# Altium project POETIC_Backplane_V2.PrjPcb
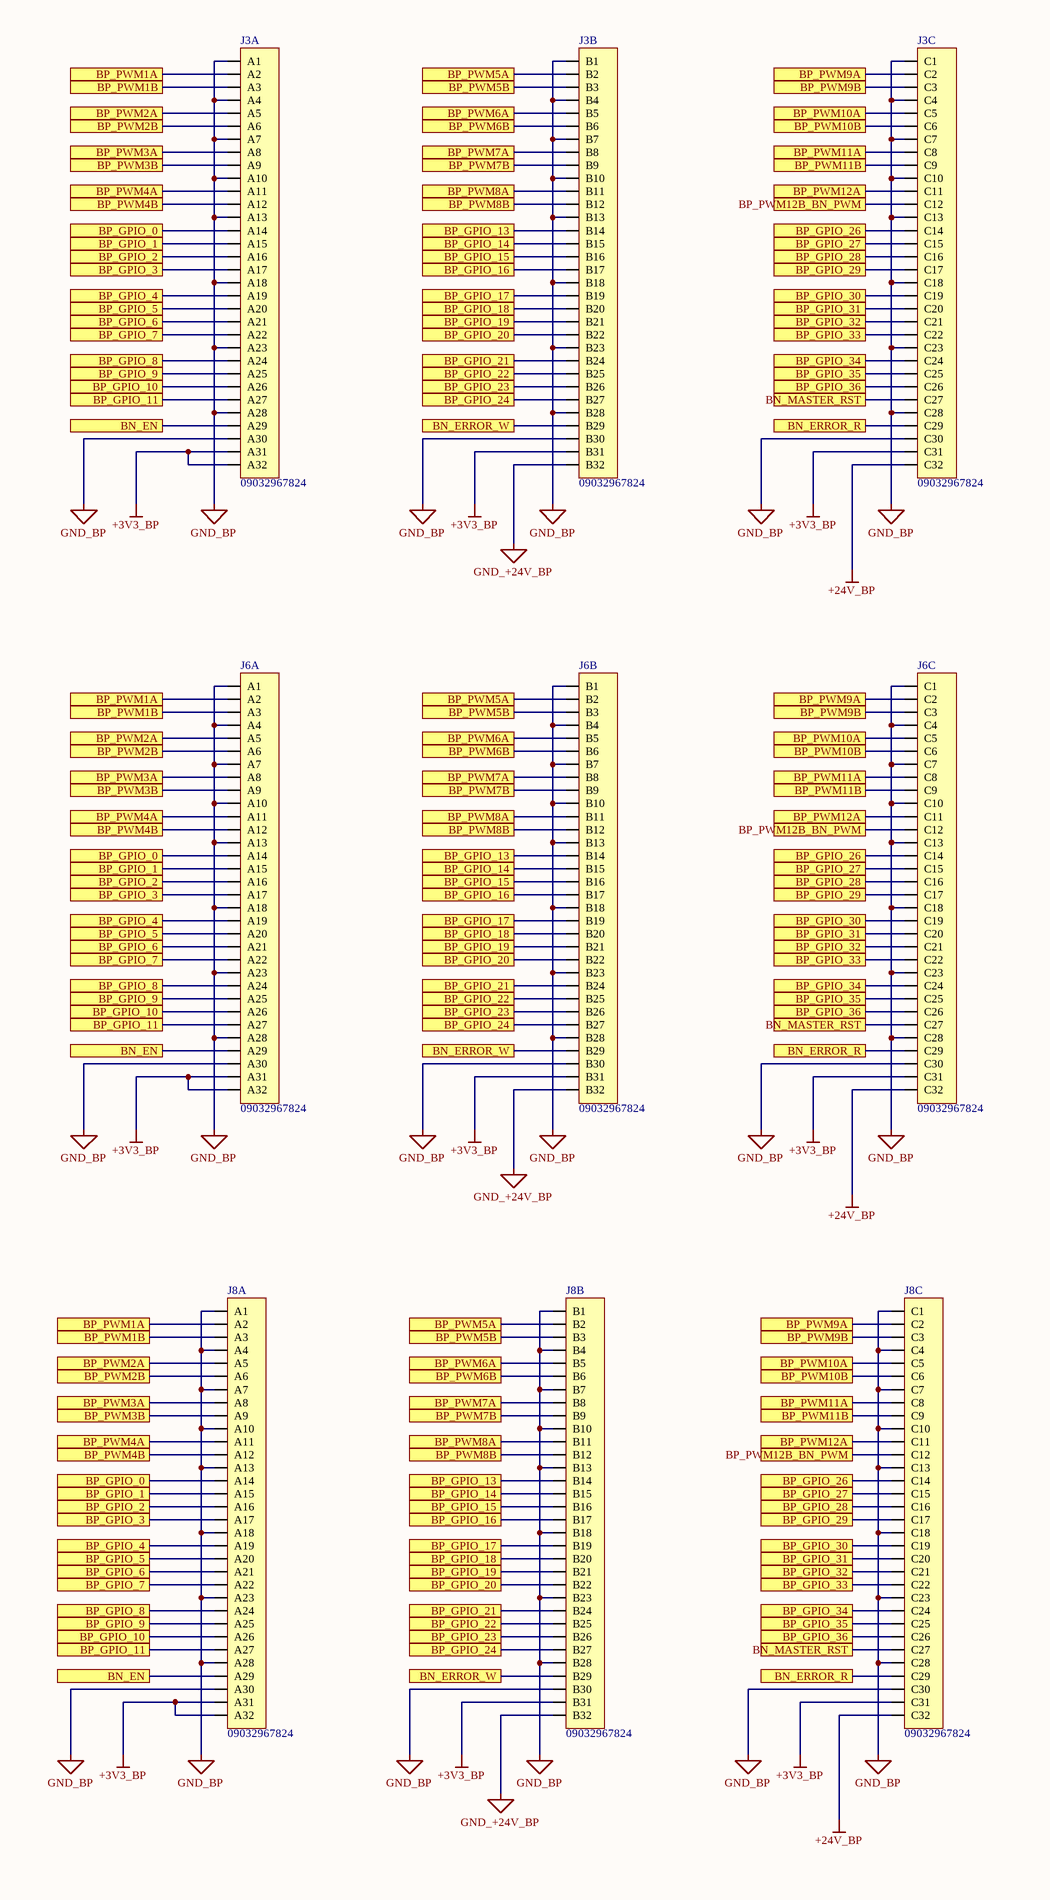
[diagram p0: Connector_1.SchDoc, left]
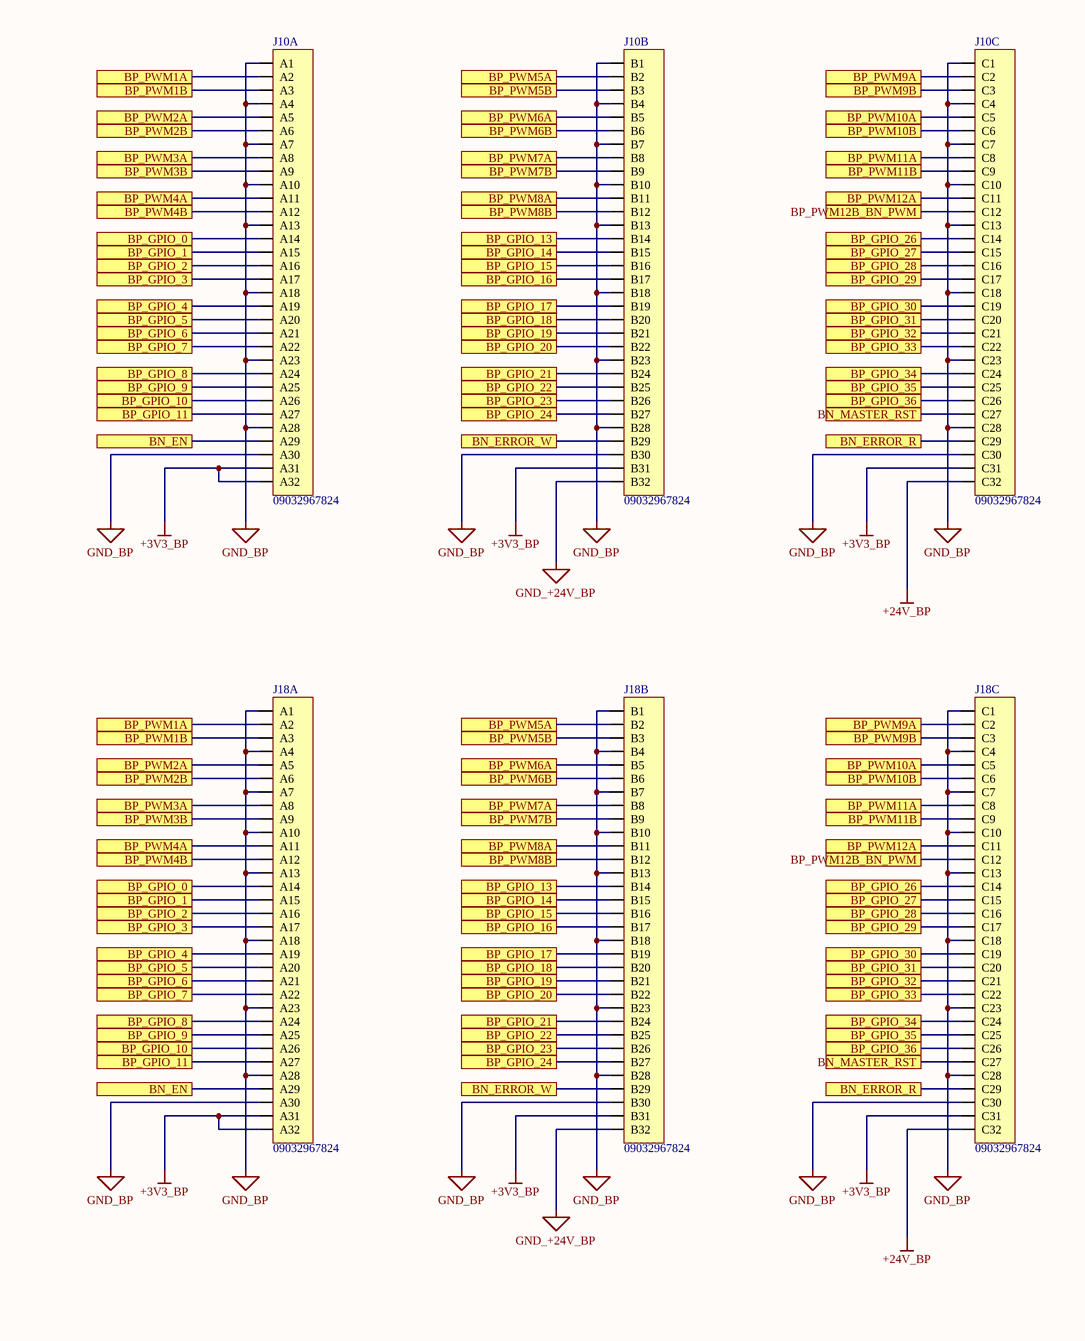
[diagram p1: Connector_1.SchDoc, right]
PcbDate: 13.03.2018; PcbDesigner: ARC; PcbRevision: 1.0; SchematicDate: 09.05.2019; SchematicDesigner: GIN/GEA; SchematicRevision: 2.0
3 sheets, 40 parts. Net scope: global (net labels, ports and power ports of the same name join across sheets).
Board file: POETIC_Backplane_V2.PcbDoc
Sheets:
  Connector_1.SchDoc
  Connector_3.SchDoc
  Supply.SchDoc

## Sheet Connector_1.SchDoc
size A2; Date: Date; CompanyName: HESSO; Engineer: Name; Address1: Route du Rawyl 47; Address2: 1950 Sion; Address3: Switzerland; DocumentNumber: 2; SheetNumber: 2; SheetTotal: 3; ProjectName: Project Name

### Parts
J3  09032967824  [DIN41612 FEM 3x32 ABC Straight]  (parts A,B,C of 3)
J6  09032967824  [DIN41612 FEM 3x32 ABC Straight]  (parts A,B,C of 3)
J8  09032967824  [DIN41612 FEM 3x32 ABC Straight]  (parts A,B,C of 3)
J10  09032967824  [DIN41612 FEM 3x32 ABC Straight]  (parts A,B,C of 3)
J18  09032967824  [DIN41612 FEM 3x32 ABC Straight]  (parts A,B,C of 3)

### Ports
BN_EN, BN_ERROR_R, BN_ERROR_W, BN_MASTER_RST, BP_GPIO_0, BP_GPIO_1, BP_GPIO_2, BP_GPIO_3, BP_GPIO_4, BP_GPIO_5, BP_GPIO_6, BP_GPIO_7, BP_GPIO_8, BP_GPIO_9, BP_GPIO_10, BP_GPIO_11, BP_GPIO_13, BP_GPIO_14, BP_GPIO_15, BP_GPIO_16, BP_GPIO_17, BP_GPIO_18, BP_GPIO_19, BP_GPIO_20, BP_GPIO_21, BP_GPIO_22, BP_GPIO_23, BP_GPIO_24, BP_GPIO_26, BP_GPIO_27, BP_GPIO_28, BP_GPIO_29, BP_GPIO_30, BP_GPIO_31, BP_GPIO_32, BP_GPIO_33, BP_GPIO_34, BP_GPIO_35, BP_GPIO_36, BP_PWM1A, BP_PWM1B, BP_PWM2A, BP_PWM2B, BP_PWM3A, BP_PWM3B, BP_PWM4A, BP_PWM4B, BP_PWM5A, BP_PWM5B, BP_PWM6A, BP_PWM6B, BP_PWM7A, BP_PWM7B, BP_PWM8A, BP_PWM8B, BP_PWM9A, BP_PWM9B, BP_PWM10A, BP_PWM10B, BP_PWM11A, BP_PWM11B, BP_PWM12A, BP_PWM12B_BN_PWM

### Nets
+3V3_BP: J3.A31 J3.A32 J3.B31 J3.C31 J6.A31 J6.A32 J6.B31 J6.C31 J8.A31 J8.A32 J8.B31 J8.C31 J10.A31 J10.A32 J10.B31 J10.C31 J18.A31 J18.A32 J18.B31 J18.C31
+24V_BP: J3.C32 J6.C32 J8.C32 J10.C32 J18.C32
GND_+24V_BP: J3.B32 J6.B32 J8.B32 J10.B32 J18.B32
GND_BP: J3.A1 J3.A4 J3.A7 J3.A10 J3.A13 J3.A18 J3.A23 J3.A28 J3.A30 J3.B1 J3.B4 J3.B7 J3.B10 J3.B13 J3.B18 J3.B23 J3.B28 J3.B30 J3.C1 J3.C4 J3.C7 J3.C10 J3.C13 J3.C18 J3.C23 J3.C28 J3.C30 J6.A1 J6.A4 J6.A7 J6.A10 J6.A13 J6.A18 J6.A23 J6.A28 J6.A30 J6.B1 J6.B4 J6.B7 J6.B10 J6.B13 J6.B18 J6.B23 J6.B28 J6.B30 J6.C1 J6.C4 J6.C7 J6.C10 J6.C13 J6.C18 J6.C23 J6.C28 J6.C30 J8.A1 J8.A4 J8.A7 J8.A10 J8.A13 J8.A18 J8.A23 J8.A28 J8.A30 J8.B1 J8.B4 J8.B7 J8.B10 J8.B13 J8.B18 J8.B23 J8.B28 J8.B30 J8.C1 J8.C4 J8.C7 J8.C10 J8.C13 J8.C18 J8.C23 J8.C28 J8.C30 J10.A1 J10.A4 J10.A7 J10.A10 J10.A13 J10.A18 J10.A23 J10.A28 J10.A30 J10.B1 J10.B4 J10.B7 J10.B10 J10.B13 J10.B18 J10.B23 J10.B28 J10.B30 J10.C1 J10.C4 J10.C7 J10.C10 J10.C13 J10.C18 J10.C23 J10.C28 J10.C30 J18.A1 J18.A4 J18.A7 J18.A10 J18.A13 J18.A18 J18.A23 J18.A28 J18.A30 J18.B1 J18.B4 J18.B7 J18.B10 J18.B13 J18.B18 J18.B23 J18.B28 J18.B30 J18.C1 J18.C4 J18.C7 J18.C10 J18.C13 J18.C18 J18.C23 J18.C28 J18.C30
BN_EN: J3.A29 J6.A29 J8.A29 J10.A29 J18.A29 ; port BN_EN
BN_ERROR_R: J3.C29 J6.C29 J8.C29 J10.C29 J18.C29 ; port BN_ERROR_R
BN_ERROR_W: J3.B29 J6.B29 J8.B29 J10.B29 J18.B29 ; port BN_ERROR_W
BN_MASTER_RST: J3.C27 J6.C27 J8.C27 J10.C27 J18.C27 ; port BN_MASTER_RST
BP_GPIO_0: J3.A14 J6.A14 J8.A14 J10.A14 J18.A14 ; port BP_GPIO_0
BP_GPIO_1: J3.A15 J6.A15 J8.A15 J10.A15 J18.A15 ; port BP_GPIO_1
BP_GPIO_2: J3.A16 J6.A16 J8.A16 J10.A16 J18.A16 ; port BP_GPIO_2
BP_GPIO_3: J3.A17 J6.A17 J8.A17 J10.A17 J18.A17 ; port BP_GPIO_3
BP_GPIO_4: J3.A19 J6.A19 J8.A19 J10.A19 J18.A19 ; port BP_GPIO_4
BP_GPIO_5: J3.A20 J6.A20 J8.A20 J10.A20 J18.A20 ; port BP_GPIO_5
BP_GPIO_6: J3.A21 J6.A21 J8.A21 J10.A21 J18.A21 ; port BP_GPIO_6
BP_GPIO_7: J3.A22 J6.A22 J8.A22 J10.A22 J18.A22 ; port BP_GPIO_7
BP_GPIO_8: J3.A24 J6.A24 J8.A24 J10.A24 J18.A24 ; port BP_GPIO_8
BP_GPIO_9: J3.A25 J6.A25 J8.A25 J10.A25 J18.A25 ; port BP_GPIO_9
BP_GPIO_10: J3.A26 J6.A26 J8.A26 J10.A26 J18.A26 ; port BP_GPIO_10
BP_GPIO_11: J3.A27 J6.A27 J8.A27 J10.A27 J18.A27 ; port BP_GPIO_11
BP_GPIO_13: J3.B14 J6.B14 J8.B14 J10.B14 J18.B14 ; port BP_GPIO_13
BP_GPIO_14: J3.B15 J6.B15 J8.B15 J10.B15 J18.B15 ; port BP_GPIO_14
BP_GPIO_15: J3.B16 J6.B16 J8.B16 J10.B16 J18.B16 ; port BP_GPIO_15
BP_GPIO_16: J3.B17 J6.B17 J8.B17 J10.B17 J18.B17 ; port BP_GPIO_16
BP_GPIO_17: J3.B19 J6.B19 J8.B19 J10.B19 J18.B19 ; port BP_GPIO_17
BP_GPIO_18: J3.B20 J6.B20 J8.B20 J10.B20 J18.B20 ; port BP_GPIO_18
BP_GPIO_19: J3.B21 J6.B21 J8.B21 J10.B21 J18.B21 ; port BP_GPIO_19
BP_GPIO_20: J3.B22 J6.B22 J8.B22 J10.B22 J18.B22 ; port BP_GPIO_20
BP_GPIO_21: J3.B24 J6.B24 J8.B24 J10.B24 J18.B24 ; port BP_GPIO_21
BP_GPIO_22: J3.B25 J6.B25 J8.B25 J10.B25 J18.B25 ; port BP_GPIO_22
BP_GPIO_23: J3.B26 J6.B26 J8.B26 J10.B26 J18.B26 ; port BP_GPIO_23
BP_GPIO_24: J3.B27 J6.B27 J8.B27 J10.B27 J18.B27 ; port BP_GPIO_24
BP_GPIO_26: J3.C14 J6.C14 J8.C14 J10.C14 J18.C14 ; port BP_GPIO_26
BP_GPIO_27: J3.C15 J6.C15 J8.C15 J10.C15 J18.C15 ; port BP_GPIO_27
BP_GPIO_28: J3.C16 J6.C16 J8.C16 J10.C16 J18.C16 ; port BP_GPIO_28
BP_GPIO_29: J3.C17 J6.C17 J8.C17 J10.C17 J18.C17 ; port BP_GPIO_29
BP_GPIO_30: J3.C19 J6.C19 J8.C19 J10.C19 J18.C19 ; port BP_GPIO_30
BP_GPIO_31: J3.C20 J6.C20 J8.C20 J10.C20 J18.C20 ; port BP_GPIO_31
BP_GPIO_32: J3.C21 J6.C21 J8.C21 J10.C21 J18.C21 ; port BP_GPIO_32
BP_GPIO_33: J3.C22 J6.C22 J8.C22 J10.C22 J18.C22 ; port BP_GPIO_33
BP_GPIO_34: J3.C24 J6.C24 J8.C24 J10.C24 J18.C24 ; port BP_GPIO_34
BP_GPIO_35: J3.C25 J6.C25 J8.C25 J10.C25 J18.C25 ; port BP_GPIO_35
BP_GPIO_36: J3.C26 J6.C26 J8.C26 J10.C26 J18.C26 ; port BP_GPIO_36
BP_PWM1A: J3.A2 J6.A2 J8.A2 J10.A2 J18.A2 ; port BP_PWM1A
BP_PWM1B: J3.A3 J6.A3 J8.A3 J10.A3 J18.A3 ; port BP_PWM1B
BP_PWM2A: J3.A5 J6.A5 J8.A5 J10.A5 J18.A5 ; port BP_PWM2A
BP_PWM2B: J3.A6 J6.A6 J8.A6 J10.A6 J18.A6 ; port BP_PWM2B
BP_PWM3A: J3.A8 J6.A8 J8.A8 J10.A8 J18.A8 ; port BP_PWM3A
BP_PWM3B: J3.A9 J6.A9 J8.A9 J10.A9 J18.A9 ; port BP_PWM3B
BP_PWM4A: J3.A11 J6.A11 J8.A11 J10.A11 J18.A11 ; port BP_PWM4A
BP_PWM4B: J3.A12 J6.A12 J8.A12 J10.A12 J18.A12 ; port BP_PWM4B
BP_PWM5A: J3.B2 J6.B2 J8.B2 J10.B2 J18.B2 ; port BP_PWM5A
BP_PWM5B: J3.B3 J6.B3 J8.B3 J10.B3 J18.B3 ; port BP_PWM5B
BP_PWM6A: J3.B5 J6.B5 J8.B5 J10.B5 J18.B5 ; port BP_PWM6A
BP_PWM6B: J3.B6 J6.B6 J8.B6 J10.B6 J18.B6 ; port BP_PWM6B
BP_PWM7A: J3.B8 J6.B8 J8.B8 J10.B8 J18.B8 ; port BP_PWM7A
BP_PWM7B: J3.B9 J6.B9 J8.B9 J10.B9 J18.B9 ; port BP_PWM7B
BP_PWM8A: J3.B11 J6.B11 J8.B11 J10.B11 J18.B11 ; port BP_PWM8A
BP_PWM8B: J3.B12 J6.B12 J8.B12 J10.B12 J18.B12 ; port BP_PWM8B
BP_PWM9A: J3.C2 J6.C2 J8.C2 J10.C2 J18.C2 ; port BP_PWM9A
BP_PWM9B: J3.C3 J6.C3 J8.C3 J10.C3 J18.C3 ; port BP_PWM9B
BP_PWM10A: J3.C5 J6.C5 J8.C5 J10.C5 J18.C5 ; port BP_PWM10A
BP_PWM10B: J3.C6 J6.C6 J8.C6 J10.C6 J18.C6 ; port BP_PWM10B
BP_PWM11A: J3.C8 J6.C8 J8.C8 J10.C8 J18.C8 ; port BP_PWM11A
BP_PWM11B: J3.C9 J6.C9 J8.C9 J10.C9 J18.C9 ; port BP_PWM11B
BP_PWM12A: J3.C11 J6.C11 J8.C11 J10.C11 J18.C11 ; port BP_PWM12A
BP_PWM12B_BN_PWM: J3.C12 J6.C12 J8.C12 J10.C12 J18.C12 ; port BP_PWM12B_BN_PWM

### Notes on the sheet
- Date :
- Revision :
- Sheet
- of
- Design by :

### Library data of the parts
J3 J6 J8 J10 J18 = DIN41612 FEM 3X32 STRAIGHT: DIN41612 FEM 3X32 ABC STRAIGHT; Manufacturer: Harting; Mouser No.: 617-09032967824; Value: 09032967824

## Sheet Connector_3.SchDoc
size A2; Date: Date; CompanyName: HESSO; Engineer: Name; Address1: Route du Rawyl 47; Address2: 1950 Sion; Address3: Switzerland; DocumentNumber: 2; SheetNumber: 2; SheetTotal: 3; ProjectName: Project Name
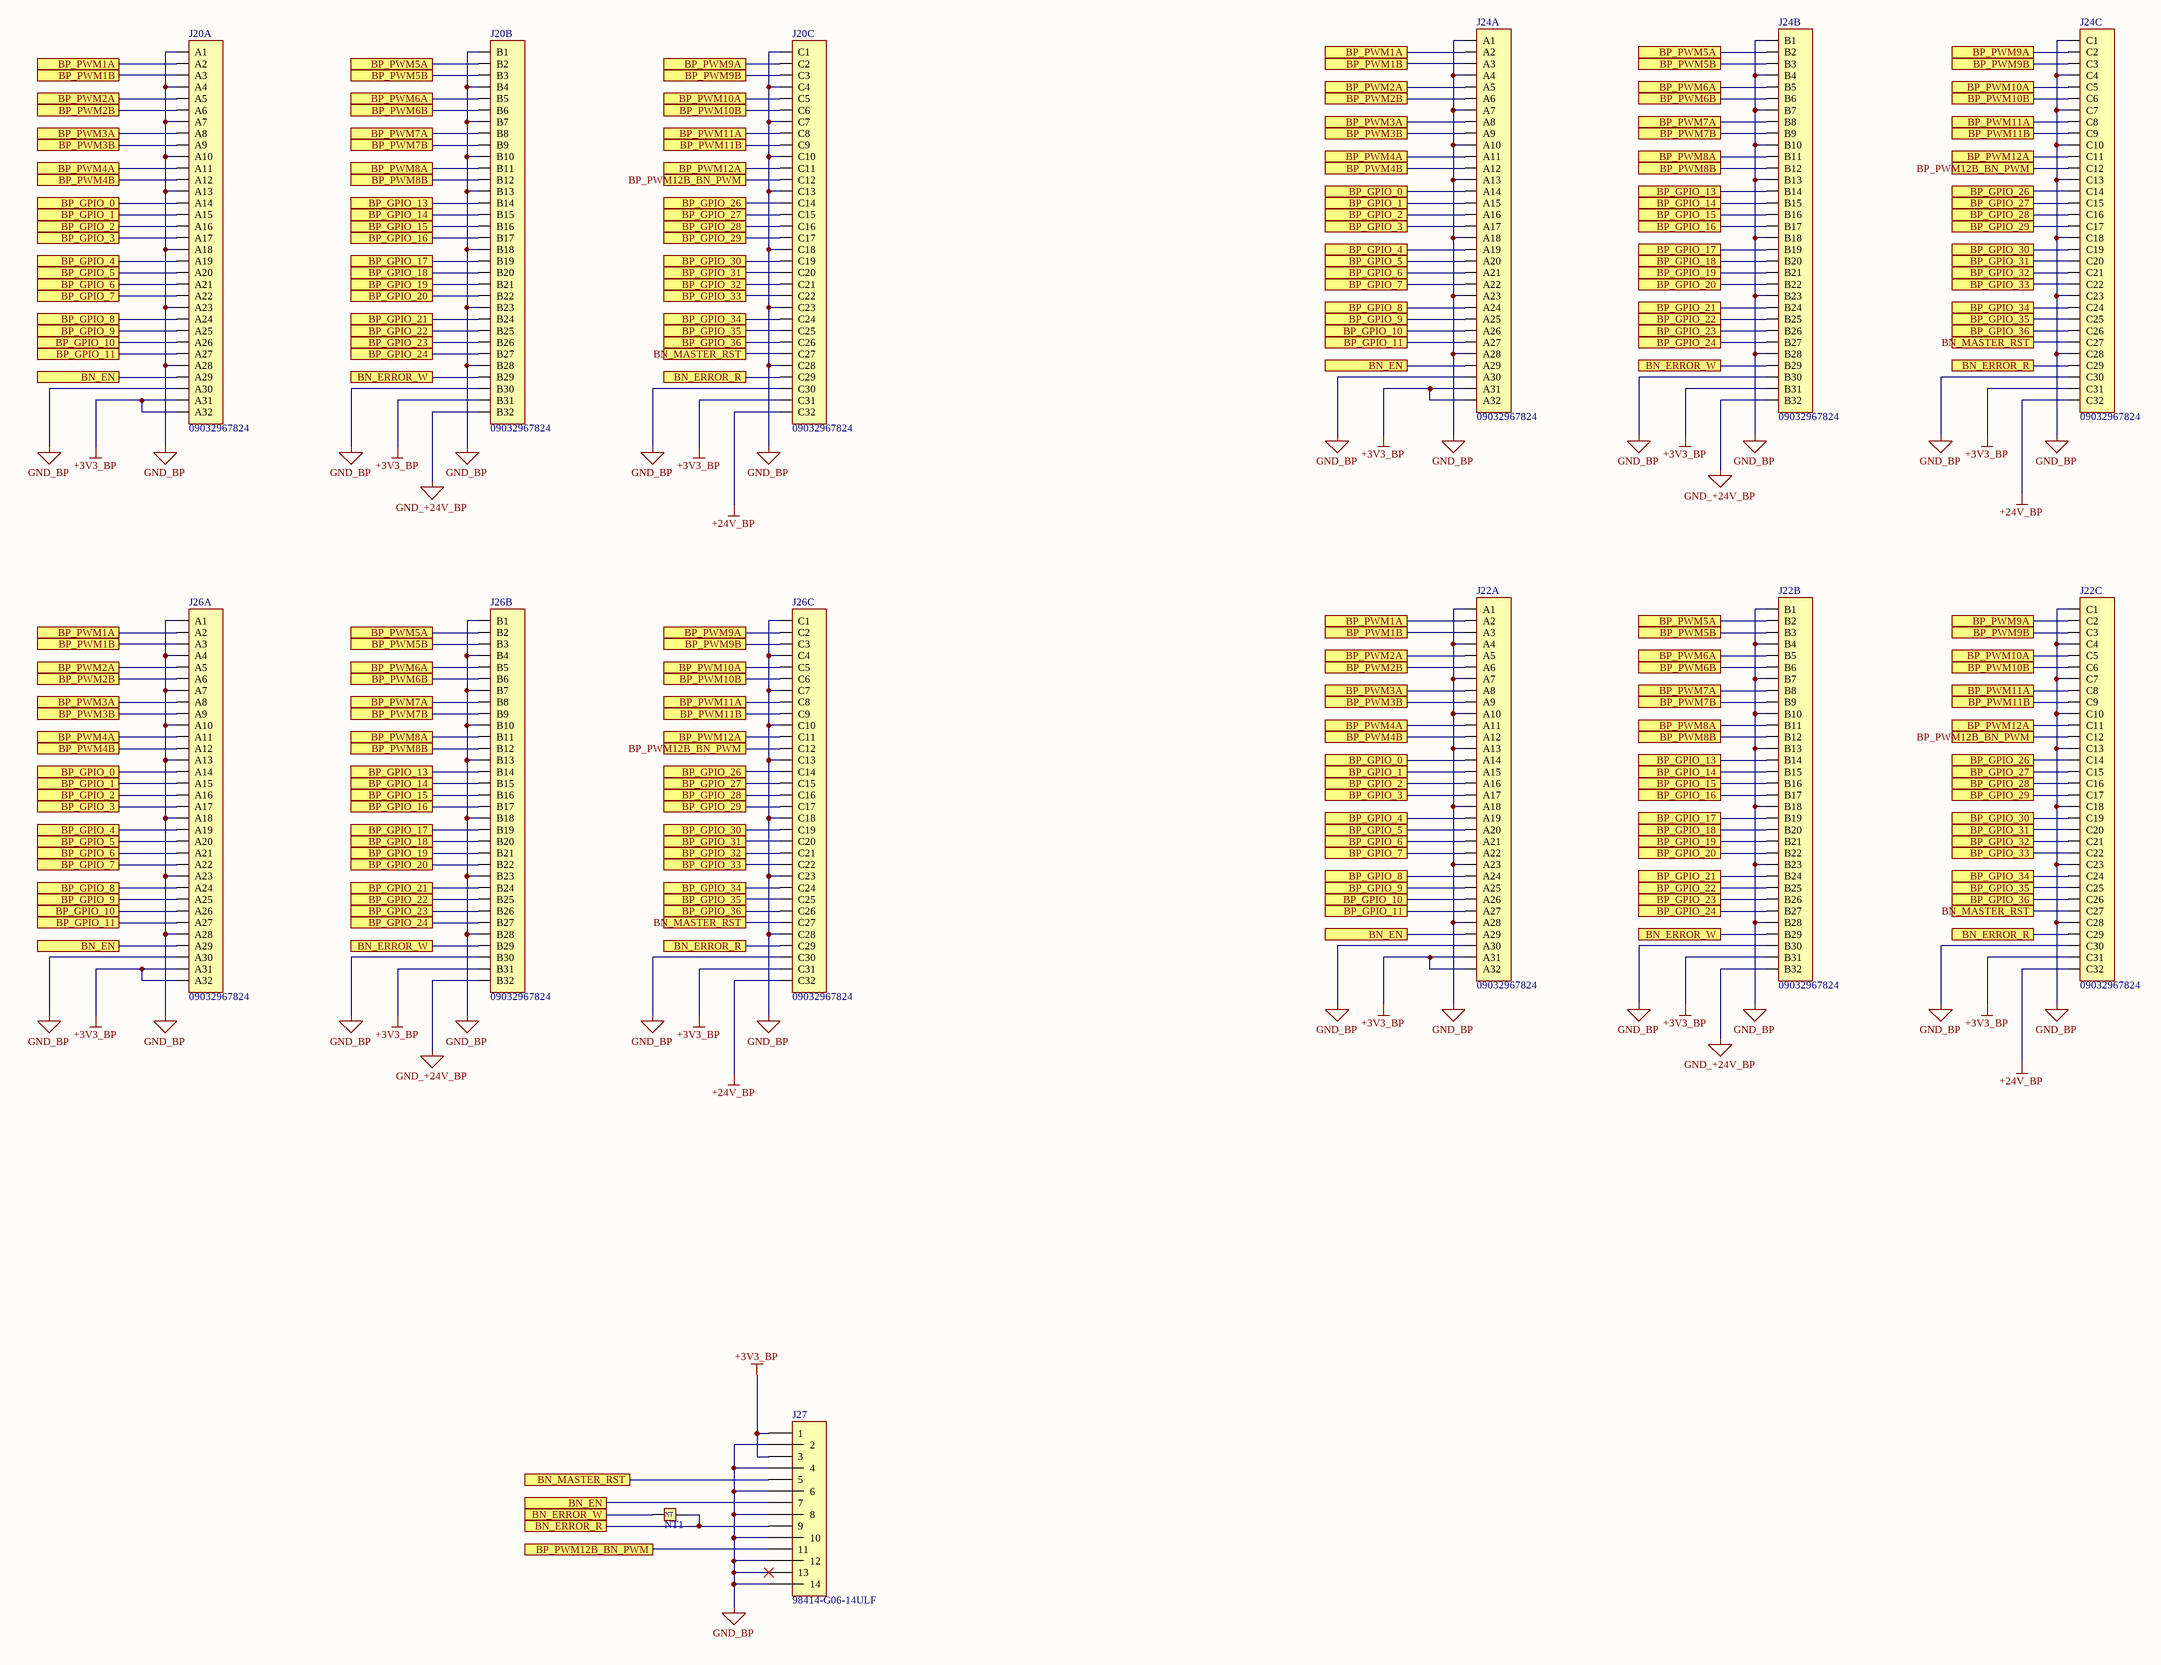
[diagram p2: Connector_3.SchDoc]

### Parts
J20  09032967824  [DIN41612 FEM 3x32 ABC Straight]  (parts A,B,C of 3)
J22  09032967824  [DIN41612 FEM 3x32 ABC Straight]  (parts A,B,C of 3)
J24  09032967824  [DIN41612 FEM 3x32 ABC Straight]  (parts A,B,C of 3)
J26  09032967824  [DIN41612 FEM 3x32 ABC Straight]  (parts A,B,C of 3)
J27  98414-G06-14ULF  [FlatCable2x7 2MM Straight TH FCI 98414-G06-14ULF]
NT1  Net Tie  [NET TIE 1005]  (value not drawn)  (net tie, no BOM)

### Ports
BN_EN, BN_ERROR_R, BN_ERROR_W, BN_MASTER_RST, BP_GPIO_0, BP_GPIO_1, BP_GPIO_2, BP_GPIO_3, BP_GPIO_4, BP_GPIO_5, BP_GPIO_6, BP_GPIO_7, BP_GPIO_8, BP_GPIO_9, BP_GPIO_10, BP_GPIO_11, BP_GPIO_13, BP_GPIO_14, BP_GPIO_15, BP_GPIO_16, BP_GPIO_17, BP_GPIO_18, BP_GPIO_19, BP_GPIO_20, BP_GPIO_21, BP_GPIO_22, BP_GPIO_23, BP_GPIO_24, BP_GPIO_26, BP_GPIO_27, BP_GPIO_28, BP_GPIO_29, BP_GPIO_30, BP_GPIO_31, BP_GPIO_32, BP_GPIO_33, BP_GPIO_34, BP_GPIO_35, BP_GPIO_36, BP_PWM1A, BP_PWM1B, BP_PWM2A, BP_PWM2B, BP_PWM3A, BP_PWM3B, BP_PWM4A, BP_PWM4B, BP_PWM5A, BP_PWM5B, BP_PWM6A, BP_PWM6B, BP_PWM7A, BP_PWM7B, BP_PWM8A, BP_PWM8B, BP_PWM9A, BP_PWM9B, BP_PWM10A, BP_PWM10B, BP_PWM11A, BP_PWM11B, BP_PWM12A, BP_PWM12B_BN_PWM

### Nets
+3V3_BP: J20.A31 J20.A32 J20.B31 J20.C31 J22.A31 J22.A32 J22.B31 J22.C31 J24.A31 J24.A32 J24.B31 J24.C31 J26.A31 J26.A32 J26.B31 J26.C31 J27.1 J27.3
+24V_BP: J20.C32 J22.C32 J24.C32 J26.C32
GND_+24V_BP: J20.B32 J22.B32 J24.B32 J26.B32
GND_BP: J20.A1 J20.A4 J20.A7 J20.A10 J20.A13 J20.A18 J20.A23 J20.A28 J20.A30 J20.B1 J20.B4 J20.B7 J20.B10 J20.B13 J20.B18 J20.B23 J20.B28 J20.B30 J20.C1 J20.C4 J20.C7 J20.C10 J20.C13 J20.C18 J20.C23 J20.C28 J20.C30 J22.A1 J22.A4 J22.A7 J22.A10 J22.A13 J22.A18 J22.A23 J22.A28 J22.A30 J22.B1 J22.B4 J22.B7 J22.B10 J22.B13 J22.B18 J22.B23 J22.B28 J22.B30 J22.C1 J22.C4 J22.C7 J22.C10 J22.C13 J22.C18 J22.C23 J22.C28 J22.C30 J24.A1 J24.A4 J24.A7 J24.A10 J24.A13 J24.A18 J24.A23 J24.A28 J24.A30 J24.B1 J24.B4 J24.B7 J24.B10 J24.B13 J24.B18 J24.B23 J24.B28 J24.B30 J24.C1 J24.C4 J24.C7 J24.C10 J24.C13 J24.C18 J24.C23 J24.C28 J24.C30 J26.A1 J26.A4 J26.A7 J26.A10 J26.A13 J26.A18 J26.A23 J26.A28 J26.A30 J26.B1 J26.B4 J26.B7 J26.B10 J26.B13 J26.B18 J26.B23 J26.B28 J26.B30 J26.C1 J26.C4 J26.C7 J26.C10 J26.C13 J26.C18 J26.C23 J26.C28 J26.C30 J27.2 J27.4 J27.6 J27.8 J27.10 J27.12 J27.13 J27.14
BN_EN: J20.A29 J22.A29 J24.A29 J26.A29 J27.7 ; port BN_EN
BN_ERROR_R: J20.C29 J22.C29 J24.C29 J26.C29 J27.9 NT1.2 ; port BN_ERROR_R
BN_ERROR_W: J20.B29 J22.B29 J24.B29 J26.B29 NT1.1 ; port BN_ERROR_W
BN_MASTER_RST: J20.C27 J22.C27 J24.C27 J26.C27 J27.5 ; port BN_MASTER_RST
BP_GPIO_0: J20.A14 J22.A14 J24.A14 J26.A14 ; port BP_GPIO_0
BP_GPIO_1: J20.A15 J22.A15 J24.A15 J26.A15 ; port BP_GPIO_1
BP_GPIO_2: J20.A16 J22.A16 J24.A16 J26.A16 ; port BP_GPIO_2
BP_GPIO_3: J20.A17 J22.A17 J24.A17 J26.A17 ; port BP_GPIO_3
BP_GPIO_4: J20.A19 J22.A19 J24.A19 J26.A19 ; port BP_GPIO_4
BP_GPIO_5: J20.A20 J22.A20 J24.A20 J26.A20 ; port BP_GPIO_5
BP_GPIO_6: J20.A21 J22.A21 J24.A21 J26.A21 ; port BP_GPIO_6
BP_GPIO_7: J20.A22 J22.A22 J24.A22 J26.A22 ; port BP_GPIO_7
BP_GPIO_8: J20.A24 J22.A24 J24.A24 J26.A24 ; port BP_GPIO_8
BP_GPIO_9: J20.A25 J22.A25 J24.A25 J26.A25 ; port BP_GPIO_9
BP_GPIO_10: J20.A26 J22.A26 J24.A26 J26.A26 ; port BP_GPIO_10
BP_GPIO_11: J20.A27 J22.A27 J24.A27 J26.A27 ; port BP_GPIO_11
BP_GPIO_13: J20.B14 J22.B14 J24.B14 J26.B14 ; port BP_GPIO_13
BP_GPIO_14: J20.B15 J22.B15 J24.B15 J26.B15 ; port BP_GPIO_14
BP_GPIO_15: J20.B16 J22.B16 J24.B16 J26.B16 ; port BP_GPIO_15
BP_GPIO_16: J20.B17 J22.B17 J24.B17 J26.B17 ; port BP_GPIO_16
BP_GPIO_17: J20.B19 J22.B19 J24.B19 J26.B19 ; port BP_GPIO_17
BP_GPIO_18: J20.B20 J22.B20 J24.B20 J26.B20 ; port BP_GPIO_18
BP_GPIO_19: J20.B21 J22.B21 J24.B21 J26.B21 ; port BP_GPIO_19
BP_GPIO_20: J20.B22 J22.B22 J24.B22 J26.B22 ; port BP_GPIO_20
BP_GPIO_21: J20.B24 J22.B24 J24.B24 J26.B24 ; port BP_GPIO_21
BP_GPIO_22: J20.B25 J22.B25 J24.B25 J26.B25 ; port BP_GPIO_22
BP_GPIO_23: J20.B26 J22.B26 J24.B26 J26.B26 ; port BP_GPIO_23
BP_GPIO_24: J20.B27 J22.B27 J24.B27 J26.B27 ; port BP_GPIO_24
BP_GPIO_26: J20.C14 J22.C14 J24.C14 J26.C14 ; port BP_GPIO_26
BP_GPIO_27: J20.C15 J22.C15 J24.C15 J26.C15 ; port BP_GPIO_27
BP_GPIO_28: J20.C16 J22.C16 J24.C16 J26.C16 ; port BP_GPIO_28
BP_GPIO_29: J20.C17 J22.C17 J24.C17 J26.C17 ; port BP_GPIO_29
BP_GPIO_30: J20.C19 J22.C19 J24.C19 J26.C19 ; port BP_GPIO_30
BP_GPIO_31: J20.C20 J22.C20 J24.C20 J26.C20 ; port BP_GPIO_31
BP_GPIO_32: J20.C21 J22.C21 J24.C21 J26.C21 ; port BP_GPIO_32
BP_GPIO_33: J20.C22 J22.C22 J24.C22 J26.C22 ; port BP_GPIO_33
BP_GPIO_34: J20.C24 J22.C24 J24.C24 J26.C24 ; port BP_GPIO_34
BP_GPIO_35: J20.C25 J22.C25 J24.C25 J26.C25 ; port BP_GPIO_35
BP_GPIO_36: J20.C26 J22.C26 J24.C26 J26.C26 ; port BP_GPIO_36
BP_PWM1A: J20.A2 J22.A2 J24.A2 J26.A2 ; port BP_PWM1A
BP_PWM1B: J20.A3 J22.A3 J24.A3 J26.A3 ; port BP_PWM1B
BP_PWM2A: J20.A5 J22.A5 J24.A5 J26.A5 ; port BP_PWM2A
BP_PWM2B: J20.A6 J22.A6 J24.A6 J26.A6 ; port BP_PWM2B
BP_PWM3A: J20.A8 J22.A8 J24.A8 J26.A8 ; port BP_PWM3A
BP_PWM3B: J20.A9 J22.A9 J24.A9 J26.A9 ; port BP_PWM3B
BP_PWM4A: J20.A11 J22.A11 J24.A11 J26.A11 ; port BP_PWM4A
BP_PWM4B: J20.A12 J22.A12 J24.A12 J26.A12 ; port BP_PWM4B
BP_PWM5A: J20.B2 J22.B2 J24.B2 J26.B2 ; port BP_PWM5A
BP_PWM5B: J20.B3 J22.B3 J24.B3 J26.B3 ; port BP_PWM5B
BP_PWM6A: J20.B5 J22.B5 J24.B5 J26.B5 ; port BP_PWM6A
BP_PWM6B: J20.B6 J22.B6 J24.B6 J26.B6 ; port BP_PWM6B
BP_PWM7A: J20.B8 J22.B8 J24.B8 J26.B8 ; port BP_PWM7A
BP_PWM7B: J20.B9 J22.B9 J24.B9 J26.B9 ; port BP_PWM7B
BP_PWM8A: J20.B11 J22.B11 J24.B11 J26.B11 ; port BP_PWM8A
BP_PWM8B: J20.B12 J22.B12 J24.B12 J26.B12 ; port BP_PWM8B
BP_PWM9A: J20.C2 J22.C2 J24.C2 J26.C2 ; port BP_PWM9A
BP_PWM9B: J20.C3 J22.C3 J24.C3 J26.C3 ; port BP_PWM9B
BP_PWM10A: J20.C5 J22.C5 J24.C5 J26.C5 ; port BP_PWM10A
BP_PWM10B: J20.C6 J22.C6 J24.C6 J26.C6 ; port BP_PWM10B
BP_PWM11A: J20.C8 J22.C8 J24.C8 J26.C8 ; port BP_PWM11A
BP_PWM11B: J20.C9 J22.C9 J24.C9 J26.C9 ; port BP_PWM11B
BP_PWM12A: J20.C11 J22.C11 J24.C11 J26.C11 ; port BP_PWM12A
BP_PWM12B_BN_PWM: J20.C12 J22.C12 J24.C12 J26.C12 J27.11 ; port BP_PWM12B_BN_PWM

### Notes on the sheet
- Date :
- Revision :
- Sheet
- of
- Design by :
- (in symbol Net Tie) NT

### Library data of the parts
J20 J22 J24 J26 = DIN41612 FEM 3X32 STRAIGHT: as J3 on sheet Connector_1; Value: 09032967824; Mouser No.: 617-09032967824
J27 = FlatCable2x7: Manufacturer: Amphenol FCI; Mouser No.: 649-98414-G06-14ULF; Value: 98414-G06-14ULF
NT1 = Net Tie: Connection for 2 different NETNAME

## Sheet Supply.SchDoc
size A2; Date: Date; CompanyName: HESSO; Engineer: Name; Address1: Route du Rawyl 47; Address2: 1950 Sion; Address3: Switzerland; DocumentNumber: 3; SheetNumber: 3; SheetTotal: 3; ProjectName: Project Name
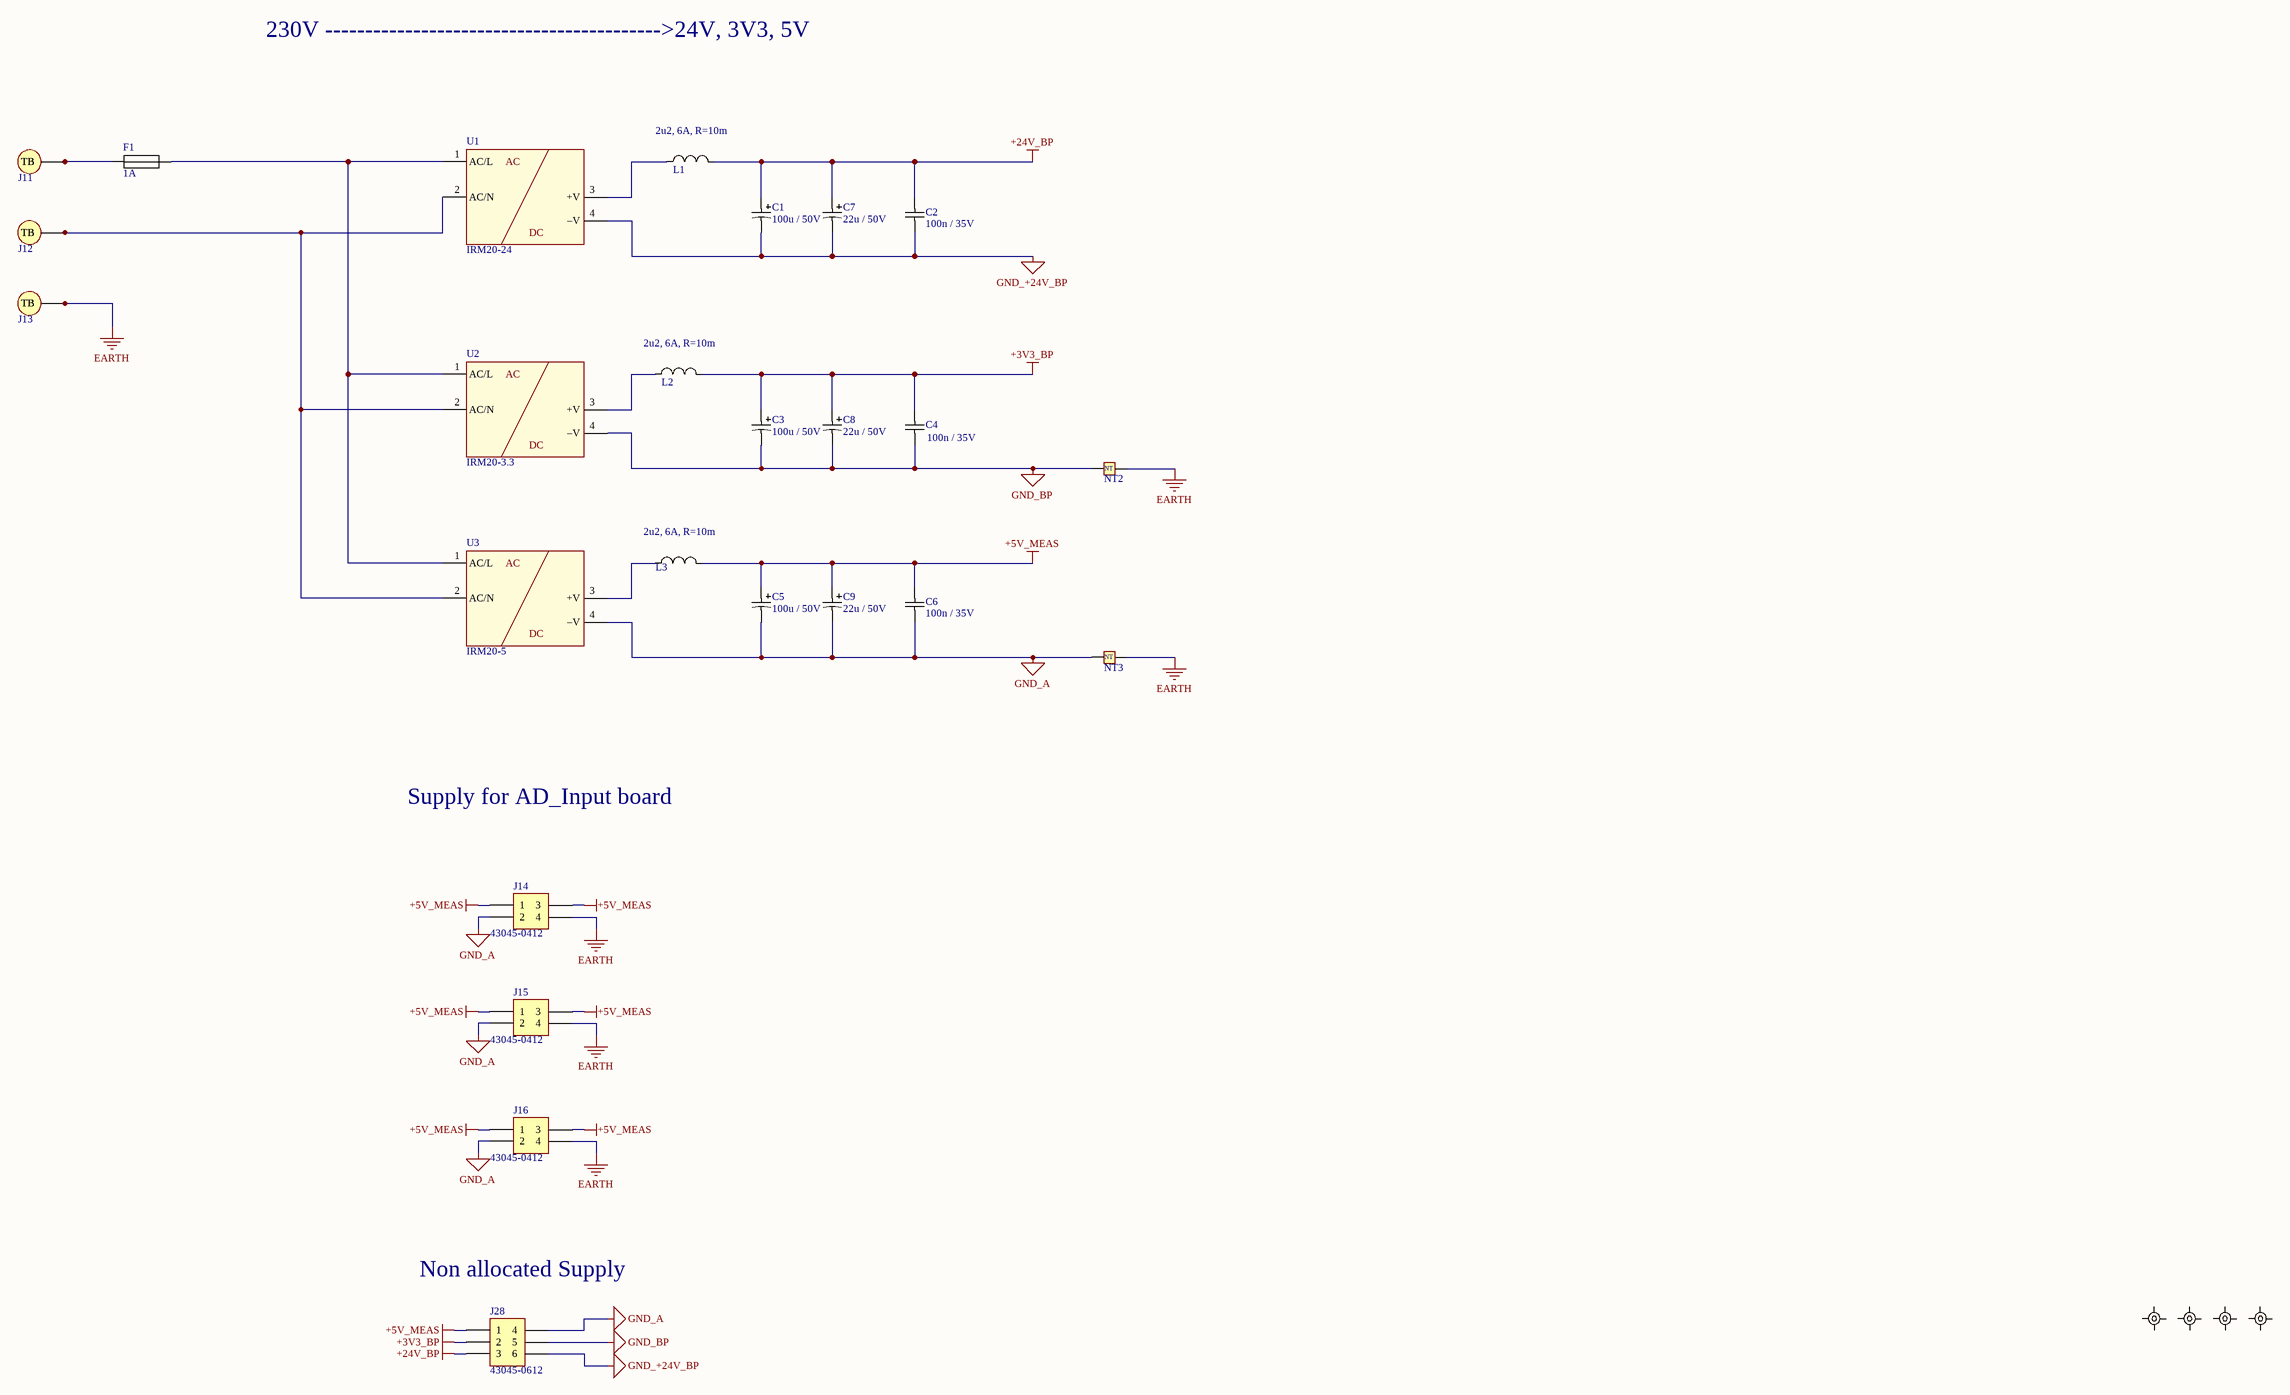
[diagram p3: Supply.SchDoc]

### Parts
C1  100u / 50V  [Capacitor POL P3.5 D8.0 H13.0]
C2  100n / 35V  [Capacitor P2.5 C4.5x2.5 H4.0]
C3  100u / 50V  [Capacitor POL P3.5 D8.0 H13.0]
C4  100n / 35V  [Capacitor P2.5 C4.5x2.5 H4.0]
C5  100u / 50V  [Capacitor POL P3.5 D8.0 H13.0]
C6  100n / 35V  [Capacitor P2.5 C4.5x2.5 H4.0]
C7  22u / 50V  [Capacitor POL P2.00 D5.5 H12.0]
C8  22u / 50V  [Capacitor POL P2.00 D5.5 H12.0]
C9  22u / 50V  [Capacitor POL P2.00 D5.5 H12.0]
F1  1A  [Fuse Cartridge 5x20 Shurter]
J11  1790351  [PC FFKDSA/H1-7,62 - 1790351]  (value not drawn)
J12  1790351  [PC FFKDSA/H1-7,62 - 1790351]  (value not drawn)
J13  1790351  [PC FFKDSA/H1-7,62 - 1790351]  (value not drawn)
J14  43045-0412  [MOLEX 43045-0412]
J15  43045-0412  [MOLEX 43045-0412]
J16  43045-0412  [MOLEX 43045-0412]
J28  43045-0612  [MOLEX 43045-0612]
L1  2u2, 6A, R=10m  [L P5.0 D10.0 H13.0]
L2  2u2, 6A, R=10m  [L P5.0 D10.0 H13.0]
L3  2u2, 6A, R=10m  [L P5.0 D10.0 H13.0]
NT2  Net Tie  [NET TIE 1005]  (value not drawn)  (net tie, no BOM)
NT3  Net Tie  [NET TIE 1005]  (value not drawn)  (net tie, no BOM)
U1  IRM20-24  [MEAN WELL IRM-20 Series]
U2  IRM20-3.3  [MEAN WELL IRM-20 Series]
U3  IRM20-5  [MEAN WELL IRM-20 Series]
Z1  1 - 3  [FIDUCIAL]  (value not drawn)
Z2  1 - 3  [FIDUCIAL]  (value not drawn)
Z3  1 - 3  [FIDUCIAL]  (value not drawn)
Z4  1 - 3  [FIDUCIAL]  (value not drawn)

### Nets
+3V3_BP: C3.1 C4.2 C8.1 J28.2 L2.2
+5V_MEAS: C5.1 C6.2 C9.1 J14.1 J14.3 J15.1 J15.3 J16.1 J16.3 J28.1 L3.2
+24V_BP: C1.1 C2.2 C7.1 J28.3 L1.2
EARTH: J13.1(TB) J13.2(TB) J14.4 J15.4 J16.4 NT2.2 NT3.2
GND_+24V_BP: C1.2 C2.1 C7.2 J28.6 U1.4(–V)
GND_A: C5.2 C6.1 C9.2 J14.2 J15.2 J16.2 J28.4 NT3.1 U3.4(–V)
GND_BP: C3.2 C4.1 C8.2 J28.5 NT2.1 U2.4(–V)
NetF1_1: F1.1 J11.1(TB) J11.2(TB)
NetF1_2: F1.2 U1.1(AC/L) U2.1(AC/L) U3.1(AC/L)
NetJ12_1: J12.1(TB) J12.2(TB) U1.2(AC/N) U2.2(AC/N) U3.2(AC/N)
NetL1_1: L1.1 U1.3(+V)
NetL2_1: L2.1 U2.3(+V)
NetL3_1: L3.1 U3.3(+V)

### Notes on the sheet
- 230V ------------------------------------------>24V, 3V3, 5V
- Supply for AD_Input board
- Non allocated Supply
- Date :
- Revision :
- Sheet
- of
- Design by :
- (in symbol MEAN WELL IRM-20 series) AC; DC
- (in symbol Net Tie) NT

### Library data of the parts
C1 C3 C5 C7-C9 = Capacitor Polarized: Manufacturer: Panasonic
  C1 C3 C5: Value: 100u / 50V; Mouser No.: 667-EEU-FR1H101
  C7-C9: Value: 22u / 50V; Mouser No.: 667-EEU-FR1H220
C2 C4 C6 = Capacitor: Value: 100n / 35V
F1 = Fuse Cartridge 5x20: Value: 1A
J11-J13 = PC FFKDSA/H1-7,62 - 1790351: Phoenix Contact PCB terminal block - FFKDSA/H1-7,62 - 1790351; Value: 1790351
J14-J16 = MOLEX 43045-0412: Micro-Fit 3.0 Vertical Header, 3.00mm Pitch, Dual Row, 4 Circuits; Manufacturer: Molex; Mouser No.: 538-43045-0412; Value: 43045-0412
J28 = MOLEX 43045-0612: Micro-Fit 3.0 Vertical Header, 3.00mm Pitch, Dual Row, 6 Circuits; Manufacturer: Molex; Mouser No.: 538-43045-0612; Value: 43045-0612
L1-L3 = Inductor: Manufacturer: Fastron; Value: 2u2, 6A, R=10m; Mouser No.: 434-07HCP-2R2M
NT2 NT3 = Net Tie: Connection for 2 different NETNAME
U1-U3 = MEAN WELL IRM-20 series: AC-DC 20W Single Output Encapsulated Type Converter
  U1: Value: IRM20-24
  U2: Value: IRM20-3.3
  U3: Value: IRM20-5
Z1-Z4 = FIDUCIAL: FIDUCIAL Din 1mm Dout 3mm; Value: 1 - 3

## Nets that join several sheets
+3V3_BP: Connector_1 (20 pins), Connector_3 (18 pins), Supply (5 pins)
+24V_BP: Connector_1 (5 pins), Connector_3 (J20.C32 J22.C32 J24.C32 J26.C32), Supply (5 pins)
GND_+24V_BP: Connector_1 (5 pins), Connector_3 (J20.B32 J22.B32 J24.B32 J26.B32), Supply (5 pins)
GND_BP: Connector_1 (135 pins), Connector_3 (116 pins), Supply (6 pins)
BN_EN: Connector_1 (5 pins), Connector_3 (5 pins)
BN_ERROR_R: Connector_1 (5 pins), Connector_3 (6 pins)
BN_ERROR_W: Connector_1 (5 pins), Connector_3 (5 pins)
BN_MASTER_RST: Connector_1 (5 pins), Connector_3 (5 pins)
BP_GPIO_0: Connector_1 (5 pins), Connector_3 (J20.A14 J22.A14 J24.A14 J26.A14)
BP_GPIO_1: Connector_1 (5 pins), Connector_3 (J20.A15 J22.A15 J24.A15 J26.A15)
BP_GPIO_2: Connector_1 (5 pins), Connector_3 (J20.A16 J22.A16 J24.A16 J26.A16)
BP_GPIO_3: Connector_1 (5 pins), Connector_3 (J20.A17 J22.A17 J24.A17 J26.A17)
BP_GPIO_4: Connector_1 (5 pins), Connector_3 (J20.A19 J22.A19 J24.A19 J26.A19)
BP_GPIO_5: Connector_1 (5 pins), Connector_3 (J20.A20 J22.A20 J24.A20 J26.A20)
BP_GPIO_6: Connector_1 (5 pins), Connector_3 (J20.A21 J22.A21 J24.A21 J26.A21)
BP_GPIO_7: Connector_1 (5 pins), Connector_3 (J20.A22 J22.A22 J24.A22 J26.A22)
BP_GPIO_8: Connector_1 (5 pins), Connector_3 (J20.A24 J22.A24 J24.A24 J26.A24)
BP_GPIO_9: Connector_1 (5 pins), Connector_3 (J20.A25 J22.A25 J24.A25 J26.A25)
BP_GPIO_10: Connector_1 (5 pins), Connector_3 (J20.A26 J22.A26 J24.A26 J26.A26)
BP_GPIO_11: Connector_1 (5 pins), Connector_3 (J20.A27 J22.A27 J24.A27 J26.A27)
BP_GPIO_13: Connector_1 (5 pins), Connector_3 (J20.B14 J22.B14 J24.B14 J26.B14)
BP_GPIO_14: Connector_1 (5 pins), Connector_3 (J20.B15 J22.B15 J24.B15 J26.B15)
BP_GPIO_15: Connector_1 (5 pins), Connector_3 (J20.B16 J22.B16 J24.B16 J26.B16)
BP_GPIO_16: Connector_1 (5 pins), Connector_3 (J20.B17 J22.B17 J24.B17 J26.B17)
BP_GPIO_17: Connector_1 (5 pins), Connector_3 (J20.B19 J22.B19 J24.B19 J26.B19)
BP_GPIO_18: Connector_1 (5 pins), Connector_3 (J20.B20 J22.B20 J24.B20 J26.B20)
BP_GPIO_19: Connector_1 (5 pins), Connector_3 (J20.B21 J22.B21 J24.B21 J26.B21)
BP_GPIO_20: Connector_1 (5 pins), Connector_3 (J20.B22 J22.B22 J24.B22 J26.B22)
BP_GPIO_21: Connector_1 (5 pins), Connector_3 (J20.B24 J22.B24 J24.B24 J26.B24)
BP_GPIO_22: Connector_1 (5 pins), Connector_3 (J20.B25 J22.B25 J24.B25 J26.B25)
BP_GPIO_23: Connector_1 (5 pins), Connector_3 (J20.B26 J22.B26 J24.B26 J26.B26)
BP_GPIO_24: Connector_1 (5 pins), Connector_3 (J20.B27 J22.B27 J24.B27 J26.B27)
BP_GPIO_26: Connector_1 (5 pins), Connector_3 (J20.C14 J22.C14 J24.C14 J26.C14)
BP_GPIO_27: Connector_1 (5 pins), Connector_3 (J20.C15 J22.C15 J24.C15 J26.C15)
BP_GPIO_28: Connector_1 (5 pins), Connector_3 (J20.C16 J22.C16 J24.C16 J26.C16)
BP_GPIO_29: Connector_1 (5 pins), Connector_3 (J20.C17 J22.C17 J24.C17 J26.C17)
BP_GPIO_30: Connector_1 (5 pins), Connector_3 (J20.C19 J22.C19 J24.C19 J26.C19)
BP_GPIO_31: Connector_1 (5 pins), Connector_3 (J20.C20 J22.C20 J24.C20 J26.C20)
BP_GPIO_32: Connector_1 (5 pins), Connector_3 (J20.C21 J22.C21 J24.C21 J26.C21)
BP_GPIO_33: Connector_1 (5 pins), Connector_3 (J20.C22 J22.C22 J24.C22 J26.C22)
BP_GPIO_34: Connector_1 (5 pins), Connector_3 (J20.C24 J22.C24 J24.C24 J26.C24)
BP_GPIO_35: Connector_1 (5 pins), Connector_3 (J20.C25 J22.C25 J24.C25 J26.C25)
BP_GPIO_36: Connector_1 (5 pins), Connector_3 (J20.C26 J22.C26 J24.C26 J26.C26)
BP_PWM1A: Connector_1 (5 pins), Connector_3 (J20.A2 J22.A2 J24.A2 J26.A2)
BP_PWM1B: Connector_1 (5 pins), Connector_3 (J20.A3 J22.A3 J24.A3 J26.A3)
BP_PWM2A: Connector_1 (5 pins), Connector_3 (J20.A5 J22.A5 J24.A5 J26.A5)
BP_PWM2B: Connector_1 (5 pins), Connector_3 (J20.A6 J22.A6 J24.A6 J26.A6)
BP_PWM3A: Connector_1 (5 pins), Connector_3 (J20.A8 J22.A8 J24.A8 J26.A8)
BP_PWM3B: Connector_1 (5 pins), Connector_3 (J20.A9 J22.A9 J24.A9 J26.A9)
BP_PWM4A: Connector_1 (5 pins), Connector_3 (J20.A11 J22.A11 J24.A11 J26.A11)
BP_PWM4B: Connector_1 (5 pins), Connector_3 (J20.A12 J22.A12 J24.A12 J26.A12)
BP_PWM5A: Connector_1 (5 pins), Connector_3 (J20.B2 J22.B2 J24.B2 J26.B2)
BP_PWM5B: Connector_1 (5 pins), Connector_3 (J20.B3 J22.B3 J24.B3 J26.B3)
BP_PWM6A: Connector_1 (5 pins), Connector_3 (J20.B5 J22.B5 J24.B5 J26.B5)
BP_PWM6B: Connector_1 (5 pins), Connector_3 (J20.B6 J22.B6 J24.B6 J26.B6)
BP_PWM7A: Connector_1 (5 pins), Connector_3 (J20.B8 J22.B8 J24.B8 J26.B8)
BP_PWM7B: Connector_1 (5 pins), Connector_3 (J20.B9 J22.B9 J24.B9 J26.B9)
BP_PWM8A: Connector_1 (5 pins), Connector_3 (J20.B11 J22.B11 J24.B11 J26.B11)
BP_PWM8B: Connector_1 (5 pins), Connector_3 (J20.B12 J22.B12 J24.B12 J26.B12)
BP_PWM9A: Connector_1 (5 pins), Connector_3 (J20.C2 J22.C2 J24.C2 J26.C2)
BP_PWM9B: Connector_1 (5 pins), Connector_3 (J20.C3 J22.C3 J24.C3 J26.C3)
BP_PWM10A: Connector_1 (5 pins), Connector_3 (J20.C5 J22.C5 J24.C5 J26.C5)
BP_PWM10B: Connector_1 (5 pins), Connector_3 (J20.C6 J22.C6 J24.C6 J26.C6)
BP_PWM11A: Connector_1 (5 pins), Connector_3 (J20.C8 J22.C8 J24.C8 J26.C8)
BP_PWM11B: Connector_1 (5 pins), Connector_3 (J20.C9 J22.C9 J24.C9 J26.C9)
BP_PWM12A: Connector_1 (5 pins), Connector_3 (J20.C11 J22.C11 J24.C11 J26.C11)
BP_PWM12B_BN_PWM: Connector_1 (5 pins), Connector_3 (5 pins)